# Altium schematic sheet CONFIGURATION_STORAGE_USER_LEDS_BUTTONS.SchDoc: CONFIGURATION_&_STORAGE_&_USER_LEDS_BUTTONS
size 420 x 297 mm; DrawnBy: Orhun Dabak; Revision: 1.0; SheetNumber: 6; SheetTotal: 7
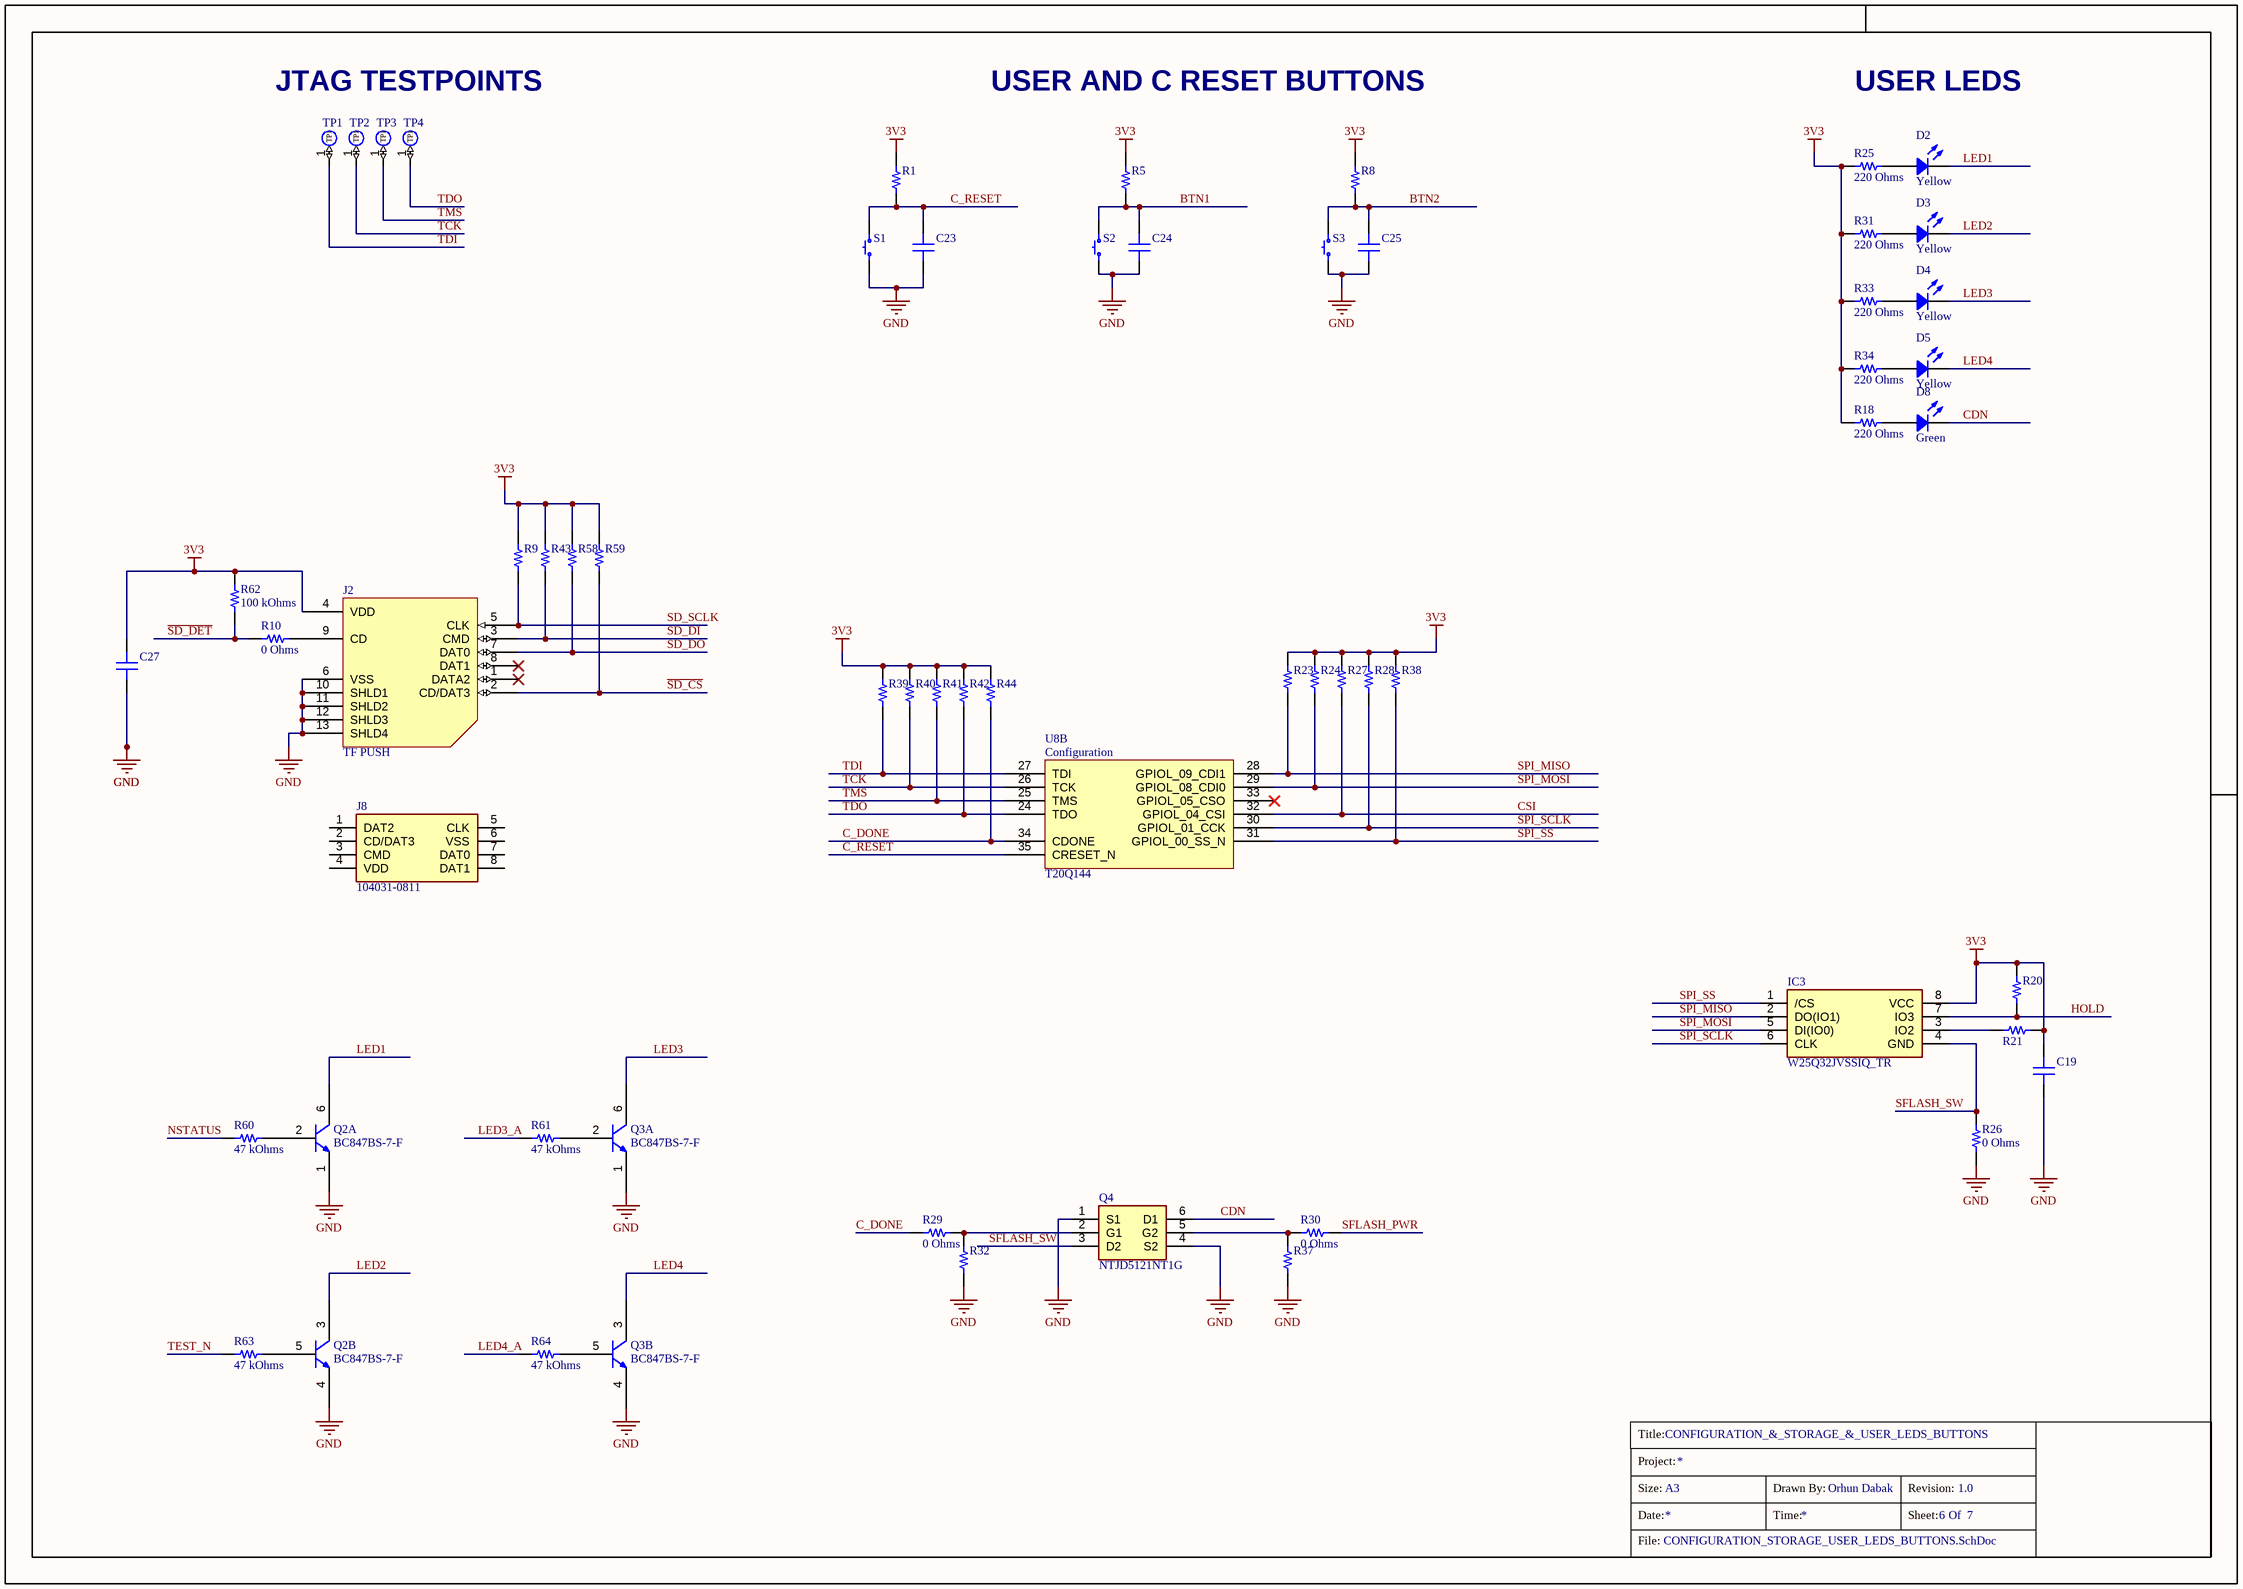
[diagram p0: CONFIGURATION_STORAGE_USER_LEDS_BUTTONS.SchDoc]

## Parts
?  (no value)  (graphical)
C19  0.1 µF  [CAP 0402_1005]  (value not drawn)
C23  10 µF  [CAP 0402_1005]  (value not drawn)
C24  10 µF  [CAP 0402_1005]  (value not drawn)
C25  10 µF  [CAP 0402_1005]  (value not drawn)
C27  0.1 µF  [CAP 0402_1005]  (value not drawn)
D2  Yellow  [LED 0603_1608 YELLOW]
D3  Yellow  [LED 0603_1608 YELLOW]
D4  Yellow  [LED 0603_1608 YELLOW]
D5  Yellow  [LED 0603_1608 YELLOW]
D8  Green  [LED 0603_1608 GREEN]
IC3  W25Q32JVSSIQ_TR  [SOIC127P790X216-8N]
J2  TF PUSH  [TF PUSH]
J8  104031-0811  [1040310811]
Q2  BC847BS-7-F  [BC847BS-7-F-Footprint-1]  (parts A,B of 2)
Q3  BC847BS-7-F  [BC847BS-7-F-Footprint-1]  (parts A,B of 2)
Q4  NTJD5121NT1G  [SOT65P210X110-6N]
R1  10 kOhms  [RES 0402_1005]  (value not drawn)
R5  10 kOhms  [RES 0402_1005]  (value not drawn)
R8  10 kOhms  [RES 0402_1005]  (value not drawn)
R9  10 kOhms  [RES 0402_1005]  (value not drawn)
R10  0 Ohms  [RES 0402_1005]
R18  220 Ohms  [RES 0402_1005]
R20  10 kOhms  [RES 0402_1005]  (value not drawn)
R21  10 kOhms  [RES 0402_1005]  (value not drawn)
R23  10 kOhms  [RES 0402_1005]  (value not drawn)
R24  10 kOhms  [RES 0402_1005]  (value not drawn)
R25  220 Ohms  [RES 0402_1005]
R26  0 Ohms  [RES 0402_1005]
R27  10 kOhms  [RES 0402_1005]  (value not drawn)
R28  10 kOhms  [RES 0402_1005]  (value not drawn)
R29  0 Ohms  [RES 0402_1005]
R30  0 Ohms  [RES 0402_1005]
R31  220 Ohms  [RES 0402_1005]
R32  10 kOhms  [RES 0402_1005]  (value not drawn)
R33  220 Ohms  [RES 0402_1005]
R34  220 Ohms  [RES 0402_1005]
R37  10 kOhms  [RES 0402_1005]  (value not drawn)
R38  10 kOhms  [RES 0402_1005]  (value not drawn)
R39  10 kOhms  [RES 0402_1005]  (value not drawn)
R40  10 kOhms  [RES 0402_1005]  (value not drawn)
R41  10 kOhms  [RES 0402_1005]  (value not drawn)
R42  10 kOhms  [RES 0402_1005]  (value not drawn)
R43  10 kOhms  [RES 0402_1005]  (value not drawn)
R44  10 kOhms  [RES 0402_1005]  (value not drawn)
R58  10 kOhms  [RES 0402_1005]  (value not drawn)
R59  10 kOhms  [RES 0402_1005]  (value not drawn)
R60  47 kOhms  [RES 0402_1005]
R61  47 kOhms  [RES 0402_1005]
R62  100 kOhms  [RES 0402_1005]
R63  47 kOhms  [RES 0402_1005]
R64  47 kOhms  [RES 0402_1005]
S1  TS342A2P-WZ  [TS342A2P-WZ]  (value not drawn)
S2  TS342A2P-WZ  [TS342A2P-WZ]  (value not drawn)
S3  TS342A2P-WZ  [TS342A2P-WZ]  (value not drawn)
TP1  TP_1  [TEST POINT]  (value not drawn)  (no BOM)
TP2  TP_1  [TEST POINT]  (value not drawn)  (no BOM)
TP3  TP_1  [TEST POINT]  (value not drawn)  (no BOM)
TP4  TP_1  [TEST POINT]  (value not drawn)  (no BOM)
U8  T20Q144  [CQFP50P2200X2200X160-144N]  (part B of 13)

## Nets
3V3: C19.2 C27.2 IC3.8(VCC) J2.4(VDD) R1.2 R5.2 R8.2 R9.2 R18.1 R20.2 R21.1 R23.2 R24.2 R25.1 R27.2 R28.2 R31.1 R33.1 R34.1 R38.2 R39.2 R40.2 R41.2 R42.2 R43.2 R44.2 R58.2 R59.2 R62.2
GND: C19.1 C23.1 C24.1 C25.1 C27.1 J2.6(VSS) J2.10(SHLD1) J2.11(SHLD2) J2.12(SHLD3) J2.13(SHLD4) Q2.1(Emitter) Q2.4(Emitter) Q3.1(Emitter) Q3.4(Emitter) Q4.1(S1) Q4.4(S2) R26.1 R32.1 R37.1 S1.1 S2.1 S3.1
BTN1: C24.2 R5.1 S2.2
BTN2: C25.2 R8.1 S3.2
C_DONE: R29.1 R44.1 U8.34(CDONE)
C_RESET: C23.2 R1.1 S1.2 U8.35(CRESET_N)
CDN: D8.2 Q4.6(D1)
CSI: R27.1 U8.32(GPIOL_04_CSI)
HOLD: IC3.7(IO3) R20.1
LED1: D2.2 Q2.6(Collector)
LED2: D3.2 Q2.3(Collector)
LED3: D4.2 Q3.6(Collector)
LED3_A: R61.1
LED4: D5.2 Q3.3(Collector)
LED4_A: R64.1
NSTATUS: R60.1
~{SD_CS}: J2.2(CD/DAT3) R59.1
~{SD_DET}: R10.1 R62.1
SD_DI: J2.3(CMD) R43.1
SD_DO: J2.7(DAT0) R58.1
SD_SCLK: J2.5(CLK) R9.1
SFLASH_PWR: R30.2
SFLASH_SW: IC3.4(GND) Q4.3(D2) R26.2
SPI_MISO: IC3.2(DO(IO1)) R23.1 U8.28(GPIOL_09_CDI1)
SPI_MOSI: IC3.5(DI(IO0)) R24.1 U8.29(GPIOL_08_CDI0)
SPI_SCLK: IC3.6(CLK) R28.1 U8.30(GPIOL_01_CCK)
SPI_SS: IC3.1(/CS) R38.1 U8.31(GPIOL_00_SS_N)
TCK: R40.1 TP2.1(TP1) U8.26(TCK)
TDI: R39.1 TP1.1(TP1) U8.27(TDI)
TDO: R42.1 TP4.1(TP1) U8.24(TDO)
TEST_N: R63.1
TMS: R41.1 TP3.1(TP1) U8.25(TMS)
NetD2_1: D2.1 R25.2
NetD3_1: D3.1 R31.2
NetD4_1: D4.1 R33.2
NetD5_1: D5.1 R34.2
NetD8_1: D8.1 R18.2
NetIC3_3: IC3.3(IO2) R21.2
NetJ2_9: J2.9(CD) R10.2
NetQ2_2: Q2.2(Base) R60.2
NetQ2_5: Q2.5(Base) R63.2
NetQ3_2: Q3.2(Base) R61.2
NetQ3_5: Q3.5(Base) R64.2
NetQ4_2: Q4.2(G1) R29.2 R32.2
NetQ4_5: Q4.5(G2) R30.1 R37.2

Not connected (* = marked no-connect by the designer): J2 1(DATA2)* 8(DAT1)*; J8 1(DAT2) 2(CD/DAT3) 3(CMD) 4(VDD) 5(CLK) 6(VSS) 7(DAT0) 8(DAT1); U8 33(GPIOL_05_CSO)*

## Notes on the sheet
- JTAG TESTPOINTS
- USER AND C RESET BUTTONS
- USER LEDS
- Title:
- Project:
- Size:
- Date:
- File:
- A3
- Time:
- Drawn By:
- Sheet:
- Revision:
- Of
- (in symbol T20Q144, part B) Configuration

## Library data of the parts
? = Title_Block
C19 C27 = CC0402KRX7R6BB104: CAP CER 0.1UF 10V X7R 0402; manufacturer: Yageo; Tolerance: ±10%; Part Number: CC0402KRX7R6BB104; Value: 0.1 µF; Applications: General Purpose; Capacitance: 0.1 µF; componentlink1description: Datasheet; componentlink1url: https://www.yageo.com/upload/media/product/productsearch/datasheet/mlcc/UPY-GPHC_X7R_6.3V-to-50V_18.pdf; componentlink2description: DigiKey Link; componentlink2url: https://www.digikey.com/en/products/detail/yageo/CC0402KRX7R6BB104/2103083; Device Package: 0402 (1005 Metric); lastupdated: 19/09/2022 12:57:28; Lifecycle Status: Active; Minimum Order: 1; Mounting Type: Surface Mount, MLCC; Operating Temperature: -55°C ~ 125°C; Package / Case: 0402 (1005 Metric); packaging: CutTape; partid: 3877; Part Status: Active; price: 0.01; series: CC; Size / Dimension: 0.039" L x 0.020" W (1.00mm x 0.50mm); Supplier 1: DigiKey; Supplier Part Number 1: 311-1345-1-ND; Temperature Coefficient: X7R; Thickness (Max): 0.022" (0.55mm); Voltage - Rated: 10V
C23-C25 = GRM155R61A106ME11D: CAP CER 10UF 10V X5R 0402; manufacturer: Murata Electronics; Tolerance: ±20%; Part Number: GRM155R61A106ME11D; Value: 10 µF; Applications: General Purpose; Capacitance: 10 µF; componentlink2description: DigiKey Link; componentlink2url: https://www.digikey.com/en/products/detail/murata-electronics/GRM155R61A106ME11D/12091056; Device Package: 0402 (1005 Metric); lastupdated: 19/09/2022 12:56:37; Lifecycle Status: Active; Minimum Order: 1; Mounting Type: Surface Mount, MLCC; Operating Temperature: -55°C ~ 85°C; Package / Case: 0402 (1005 Metric); packaging: TapeAndReel; partid: 45464; Part Status: Active; price: 0.02; series: GRM; Size / Dimension: 0.039" L x 0.020" W (1.00mm x 0.50mm); Supplier 1: DigiKey; Supplier Part Number 1: 490-GRM155R61A106ME11DCT-ND; Temperature Coefficient: X5R; Thickness (Max): 0.028" (0.70mm); Voltage - Rated: 10V
D2-D5 = SML-LX0603YW-TR: LED YELLOW DIFFUSED SMD; Manufacturer: Lumex Opto/Components Inc.; Configuration: Standard; Current - Test: 20mA; Lens Color: White; Lens Size: 1.00mm x 0.80mm; Lens Style: Rectangle with Flat Top; Millicandela Rating: 14mcd; Viewing Angle: 160°; Voltage - Forward (Vf) (Typ): 2.1V; Wavelength - Peak: 585nm; Part Number: SML-LX0603YW-TR; Color: Yellow; ComponentLink1Description: Datasheet; ComponentLink1URL: https://www.lumex.com/content/files/ProductAttachment/SML-LX0603YW-TR.pdf; ComponentLink2Description: DigiKey Link; ComponentLink2URL: https://www.digikey.com/en/products/detail/lumex-opto-components-inc/SML-LX0603YW-TR/304361; Device Package: 0603 (1608 Metric); Height (Max): 0.60mm; LastUpdated: 19/09/2022 13:51:05; Lens Transparency: Diffused; Lifecycle Status: Active; Minimum Order: 1; Mounting Type: Surface Mount; Package / Case: 0603 (1608 Metric); Packaging: TapeAndReel; PartId: 92; Part Status: Active; Price: 0.05; Series: -; Size / Dimension: 1.60mm L x 0.80mm W; Supplier 1: DigiKey; Supplier Part Number 1: 67-1550-1-ND; Value: Yellow
D8 = LSM0603453V: LED SM 0603 3V -/1000/-MCD GREEN; Manufacturer: Visual Communications Company - VCC; Configuration: Standard; Current - Test: 20mA; Lens Color: Colorless; Lens Size: 1.20mm x 0.80mm; Lens Style: Rectangle with Flat Top; Lens Transparency: Clear; Millicandela Rating: 63mcd; Viewing Angle: 120°; Voltage - Forward (Vf) (Typ): 2V; Wavelength - Dominant: 572nm; Wavelength - Peak: 571nm; Part Number: LSM0603453V; Color: Green; ComponentLink1Description: Datasheet; ComponentLink1URL: https://vcclite.com/wp-content/uploads/wpallimport/files/files/LSM0603453V.pdf; ComponentLink2Description: DigiKey Link; ComponentLink2URL: https://www.digikey.com/en/products/detail/visual-communications-company-vcc/LSM0603453V/9486724; Device Package: 0603 (1608 Metric); Height (Max): 0.65mm; LastUpdated: 19/09/2022 13:49:59; Lifecycle Status: Active; Minimum Order: 1; Mounting Type: Surface Mount; Package / Case: 0603 (1608 Metric); Packaging: TapeAndReel; PartId: 579; Part Status: Active; Price: 0.05; Series: LSM0603; Size / Dimension: 1.60mm L x 0.80mm W; Supplier 1: DigiKey; Supplier Part Number 1: LSM0603453VCT-ND; Supplier Device Package: Chip LED; Value: Green
IC3 = W25Q32JVSSIQ_TR: Integrated Circuit; Manufacturer_Name: Winbond; Manufacturer_Part_Number: W25Q32JVSSIQ TR; Datasheet Link: https://www.winbond.com/resource-files/w25q32jv%20spi%20revc%2008302016.pdf; Height: 2.16mm; Mouser Part Number: 454-W25Q32JVSSIQTR; Mouser Price/Stock: https://www.mouser.co.uk/ProductDetail/Winbond/W25Q32JVSSIQ-TR?qs=qSfuJ%252Bfl%2Fd73AdQzQa%2FEuA%3D%3D; Arrow Part Number: W25Q32JVSSIQ TR; Arrow Price/Stock: https://www.arrow.com/en/products/w25q32jvssiqtr/winbond-electronics?region=nac
J2 = TF PUSH: -20℃~+90℃ 2mm Deck MicroSD card (TF card) Self bomb SMD SD Card Connectors ROHS; Manufacturer: SHOU HAN; ComponentLink1Description: Datasheet; ComponentLink1URL: https://datasheet.lcsc.com/lcsc/1912111437_SHOU-HAN-TF-PUSH_C393941.pdf; ComponentLink2Description: LCSC Link; ComponentLink2URL: https://www.lcsc.com/product-detail/SD-Card-Connectors_SHOU-HAN-TF-PUSH_C393941.html; Manufacturer Part Number: TF PUSH; LCSC Part Number: C393941; Package: SMD; Category: Connectors/SD Card Connectors; Operating Temperature Range: -20℃~+90℃; Maximum Body Height: 2mm; Connector Type: Deck; Card Type: MicroSD card (TF card); Card Connection Mode: Self bomb
J8 = 104031-0811: Connector; Manufacturer_Name: Molex; Datasheet Link: http://www.molex.com/webdocs/datasheets/pdf/en-us/1040310811_MEMORY_CARD_SOCKET.pdf; Manufacturer_Part_Number: 104031-0811; Mouser Part Number: 538-104031-0811; Mouser Price/Stock: https://www.mouser.co.uk/ProductDetail/Molex/104031-0811?qs=udsGRKD4nA3Tvy7wqky%252BuA%3D%3D
Q2 Q3 = CMP-013-00035-3: 2NPN Ic=100mA Vceo=45V hfe=200~450 P=200mW SOT363
Q4 = NTJD5121NT1G: Transistor; Manufacturer_Name: onsemi; Datasheet Link: http://www.onsemi.com/pub/Collateral/NTJD5121N-D.PDF; Height: 1.1mm; Manufacturer_Part_Number: NTJD5121NT1G; Mouser Part Number: 863-NTJD5121NT1G; Mouser Price/Stock: https://www.mouser.co.uk/ProductDetail/onsemi/NTJD5121NT1G?qs=E94NKttrCwxgtZwNB18zeg%3D%3D; Arrow Part Number: NTJD5121NT1G; Arrow Price/Stock: https://www.arrow.com/en/products/ntjd5121nt1g/on-semiconductor?region=nac
R1 R5 R8 R9 R20 R21 R23 R24 R27 R28 R32 R37-R44 R58 R59 = RP73PF1E10KBTD: RES 10K OHM 0.1% 1/10W 0402; Manufacturer: TE Connectivity Passive Product; Power (Watts): 0.1W, 1/10W; Temperature Coefficient: ±25ppm/°C; Part Number: RP73PF1E10KBTD; Value: 10 kOhms; ComponentLink1Description: Datasheet; ComponentLink1URL: https://www.te.com/commerce/DocumentDelivery/DDEController?Action=srchrtrv&DocNm=1773272&DocType=DS&DocLang=English; ComponentLink2Description: DigiKey Link; ComponentLink2URL: https://www.digikey.com/en/products/detail/te-connectivity-passive-product/RP73PF1E10KBTD/8260957; Composition: Thin Film; Device Package: 0402 (1005 Metric); Height - Seated (Max): 0.014" (0.35mm); LastUpdated: 9/19/2022 01:15:04 PM; Lifecycle Status: Active; Minimum Order: 1; Number of Terminations: 2; Operating Temperature: -55°C ~ 155°C; Package / Case: 0402 (1005 Metric); Packaging: TapeAndReel; PartId: 2434; Part Status: Active; Price: 0.09; Resistance: 10 kOhms; Series: RP73, Holsworthy; Size / Dimension: 0.039" L x 0.020" W (1.00mm x 0.50mm); Supplier 1: DigiKey; Supplier Part Number 1: A127415CT-ND; Supplier Device Package: 0402; Tolerance: ±0.1%
R10 R26 R29 R30 = RC0402JR-070RL: RES 0 OHM JUMPER 1/16W 0402; Manufacturer: Yageo; Power (Watts): 0.063W, 1/16W; Part Number: RC0402JR-070RL; Value: 0 Ohms; ComponentLink1Description: Datasheet; ComponentLink1URL: https://www.yageo.com/upload/media/product/productsearch/datasheet/rchip/PYu-RC_Group_51_RoHS_L_10.pdf; ComponentLink2Description: DigiKey Link; ComponentLink2URL: https://www.digikey.com/en/products/detail/yageo/RC0402JR-070RL/726406; Composition: Thick Film; Device Package: 0402 (1005 Metric); Features: Moisture Resistant; Height - Seated (Max): 0.016" (0.40mm); LastUpdated: 1/2/2023 08:20:46 PM; Lifecycle Status: Active; Minimum Order: 1; Number of Terminations: 2; Operating Temperature: -55°C ~ 155°C; Package / Case: 0402 (1005 Metric); Packaging: CutTape; PartId: 17588; Part Status: Active; Price: 0.01; Resistance: 0 Ohms; Series: RC_L; Size / Dimension: 0.039" L x 0.020" W (1.00mm x 0.50mm); Supplier 1: DigiKey; Supplier Part Number 1: 311-0.0JRCT-ND; Supplier Device Package: 0402; Tolerance: Jumper
R18 R25 R31 R33 R34 = RC0402FR-07220RL: RES 220 OHM 1% 1/16W 0402; Manufacturer: Yageo; Power (Watts): 0.063W, 1/16W; Temperature Coefficient: ±100ppm/°C; Part Number: RC0402FR-07220RL; Value: 220 Ohms; ComponentLink1Description: Datasheet; ComponentLink1URL: https://www.yageo.com/upload/media/product/productsearch/datasheet/rchip/PYu-RC_Group_51_RoHS_L_10.pdf; ComponentLink2Description: DigiKey Link; ComponentLink2URL: https://www.digikey.com/en/products/detail/yageo/RC0402FR-07220RL/726565; Composition: Thick Film; Device Package: 0402 (1005 Metric); Features: Moisture Resistant; Height - Seated (Max): 0.016" (0.40mm); LastUpdated: 19/09/2022 13:14:14; Lifecycle Status: Active; Minimum Order: 1; Number of Terminations: 2; Operating Temperature: -55°C ~ 155°C; Package / Case: 0402 (1005 Metric); Packaging: CutTape; PartId: 17956; Part Status: Active; Price: 0.01; Resistance: 220 Ohms; Series: RC_L; Size / Dimension: 0.039" L x 0.020" W (1.00mm x 0.50mm); Supplier 1: DigiKey; Supplier Part Number 1: 311-220LRCT-ND; Supplier Device Package: 0402; Tolerance: ±1%
R60 R61 R63 R64 = RMCF0402FT47K0: RES 47K OHM 1% 1/16W 0402; Manufacturer: Stackpole Electronics Inc; Power (Watts): 0.063W, 1/16W; Temperature Coefficient: ±100ppm/°C; Part Number: RMCF0402FT47K0; Value: 47 kOhms; ComponentLink1Description: Datasheet; ComponentLink1URL: https://www.seielect.com/catalog/sei-rmcf_rmcp.pdf; ComponentLink2Description: DigiKey Link; ComponentLink2URL: https://www.digikey.com/en/products/detail/stackpole-electronics-inc/RMCF0402FT47K0/1714749; Composition: Thick Film; Device Package: 0402 (1005 Metric); Features: Automotive AEC-Q200; Height - Seated (Max): 0.016" (0.40mm); LastUpdated: 1/2/2023 08:21:41 PM; Lifecycle Status: Active; Minimum Order: 1; Number of Terminations: 2; Operating Temperature: -55°C ~ 155°C; Package / Case: 0402 (1005 Metric); Packaging: CutTape; PartId: 4957; Part Status: Active; Price: 0.01; Ratings: AEC-Q200; Resistance: 47 kOhms; Series: RMCF; Size / Dimension: 0.039" L x 0.020" W (1.00mm x 0.50mm); Supplier 1: DigiKey; Supplier Part Number 1: RMCF0402FT47K0CT-ND; Supplier Device Package: 0402; Tolerance: ±1%
R62 = RT0402FRE07100KL: RES SMD 100K OHM 1% 1/16W 0402; Manufacturer: Yageo; Power (Watts): 0.063W, 1/16W; Temperature Coefficient: ±50ppm/°C; Part Number: RT0402FRE07100KL; Value: 100 kOhms; ComponentLink1Description: Datasheet; ComponentLink1URL: https://www.yageo.com/upload/media/product/productsearch/datasheet/rchip/PYu-RT_1-to-0.01_RoHS_L_11.pdf; ComponentLink2Description: DigiKey Link; ComponentLink2URL: https://www.digikey.com/en/products/detail/yageo/RT0402FRE07100KL/1071698; Composition: Thin Film; Device Package: 0402 (1005 Metric); Height - Seated (Max): 0.014" (0.35mm); LastUpdated: 1/2/2023 08:21:49 PM; Lifecycle Status: Active; Minimum Order: 1; Number of Terminations: 2; Operating Temperature: -55°C ~ 155°C; Package / Case: 0402 (1005 Metric); Packaging: TapeAndReel; PartId: 3190; Part Status: Active; Price: 0.01; Resistance: 100 kOhms; Series: RT; Size / Dimension: 0.039" L x 0.020" W (1.00mm x 0.50mm); Supplier 1: DigiKey; Supplier Part Number 1: YAG2307CT-ND; Supplier Device Package: 0402; Tolerance: ±1%
S1-S3 = TS342A2P-WZ: NO SMDSplicing 50mA 3.95mm 100MΩ 30000 12V 2.9mm -25℃~+70℃ 2mm Black Round Button Brick nogging SPST SMD Tactile Switches ROHS; Manufacturer: SHOU HAN; Mechanical Life: 30000; ComponentLink1Description: Datasheet; ComponentLink1URL: https://datasheet.lcsc.com/lcsc/2005221232_SHOU-HAN-TS342A2P-WZ_C557591.pdf; ComponentLink2Description: LCSC Link; ComponentLink2URL: https://www.lcsc.com/product-detail/Tactile-Switches_SHOU-HAN-TS342A2P-WZ_C557591.html; Manufacturer Part Number: TS342A2P-WZ; JLCPCB Part Number: C557591; Package: SMD; Contact Current: 50mA; Switch Length: 3.95mm; Insulation Resistance: 100MΩ; Voltage Rating (DC): 12V; Switch Width: 2.9mm; Actuator/Cap Color: Black; Actuator Style: Round Button; Mounting Style: Brick nogging; Circuit: SPST
TP1-TP4 = TEST POINT_1(I/O): 1.5x1.5mm Test Point(I/O)
U8 = T20Q144: Trion® Field Programmable Gate Array (FPGA) IC 97 1044 19728 144-LQFP